# EAGLE design injector (EAGLE 6.5.0)
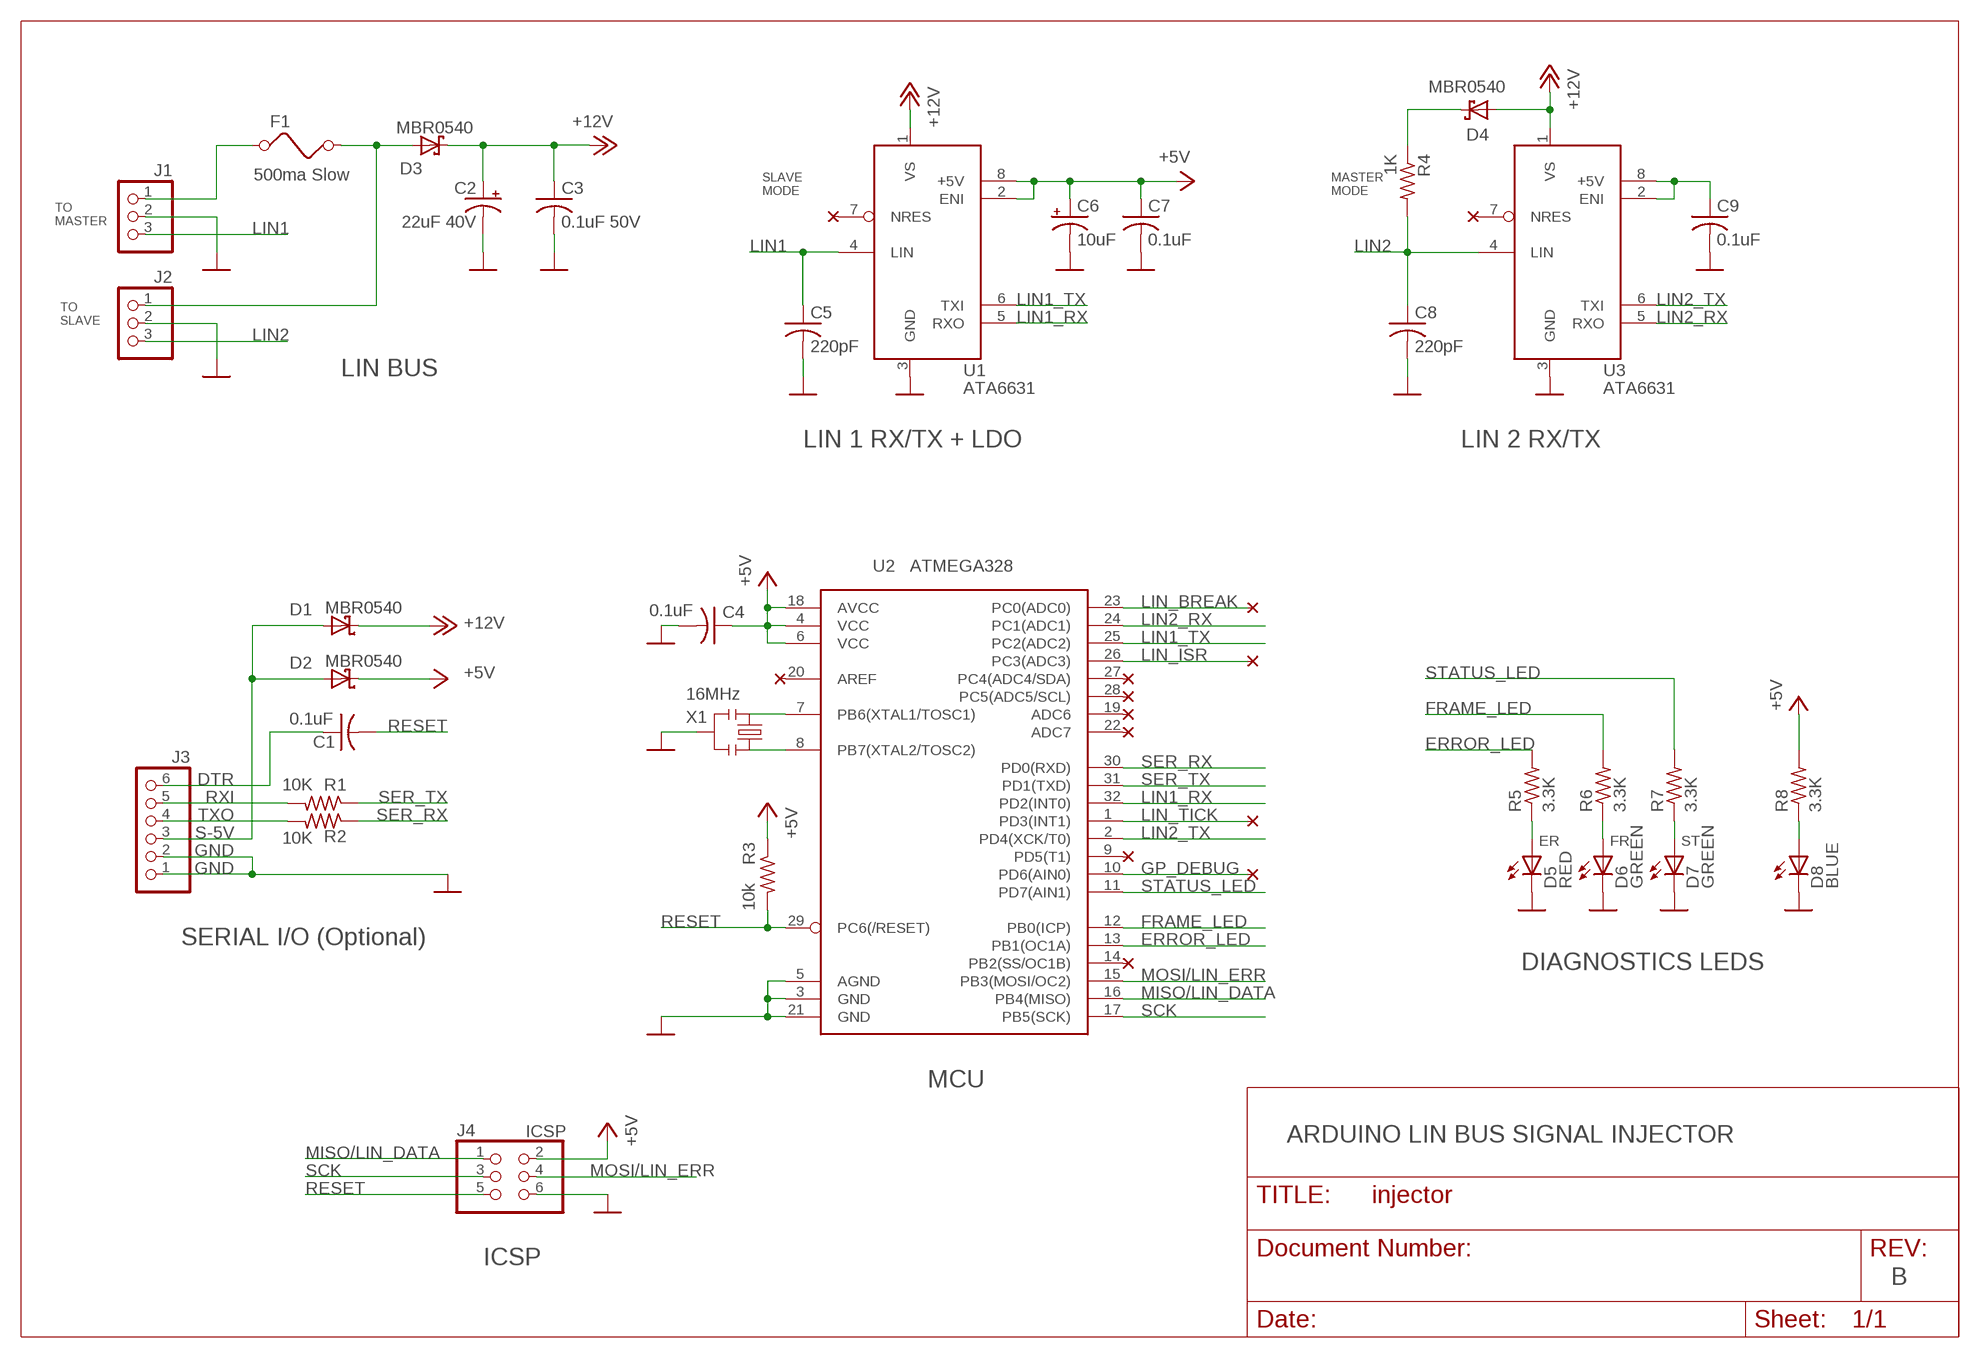
[diagram p0: schematic, sheet 1]

## Parts
C1  0.1uF  C-USC0805  [C0805]
C2  22uF 40V  CPOL-USUD-6,3X5,8  [UD-6,3X5,8_NICHICON]
C3  0.1uF 50V  C-USC0805  [C0805]
C4  0.1uF  C-USC0805  [C0805]
C5  220pF  C-USC0805  [C0805]
C6  10uF  CPOL-USA/3216-18R  [A/3216-18R]
C7  0.1uF  C-USC0805  [C0805]
C8  220pF  C-USC0805  [C0805]
C9  0.1uF  C-USC0805  [C0805]
D1  MBR0540  SMF5.0AT1  [SOD123FL]
D2  MBR0540  SMF5.0AT1  [SOD123FL]
D3  MBR0540  SMF5.0AT1  [SOD123FL]
D4  MBR0540  SMF5.0AT1  [SOD123FL]
D5  RED  LED  [1206-LED]
D6  GREEN  LED  [1206-LED]
D7  GREEN  LED  [1206-LED]
D8  BLUE  LED  [1206-LED]
F1  500ma Slow  FUSE  [1206]
J1  PINHD-1X3  [1X03]
J2  PINHD-1X3  [1X03]
J3  PINHD-1X6  [1X06]
J4  ICSP  PINHD-2X3  [2X03]
R1  10K  R-US_R0805  [R0805]
R2  10K  R-US_R0805  [R0805]
R3  10k  R-US_R0805  [R0805]
R4  1K  R-US_R0805  [R0805]
R5  3.3K  R-US_R0805  [R0805]
R6  3.3K  R-US_R0805  [R0805]
R7  3.3K  R-US_R0805  [R0805]
R8  3.3K  R-US_R0805  [R0805]
U1  ATA6631  [SO-08]
U2  ATMEGA328  [TQFP32-08]
U3  ATA6631  [SO-08]
X1  16MHz  RESONATORSMD  [RESONATOR-SMD]

## Nets
+5V: C4.1 C6.+ C7.1 D2.C J4.2 R3.1 R8.2 U1.2(ENI) U1.8(+5V) U2.4(VCC) U2.6(VCC) U2.18(AVCC)
+12V: C2.+ C3.1 D1.C D3.C D4.A U1.1(VS) U3.1(VS)
DTR: C1.1 J3.6
ERROR_LED: R5.2 U2.13(PB1(OC1A))
FRAME_LED: R6.2 U2.12(PB0(ICP))
GND: C2.- C3.2 C4.2 C5.2 C6.- C7.2 C8.2 C9.2 D5.C D6.C D7.C D8.C J1.2 J2.2 J3.1 J3.2 J4.6 U1.3(GND) U2.3(GND) U2.5(AGND) U2.21(GND) U3.3(GND) X1.2
GP_DEBUG: U2.10(PD6(AIN0))
LIN1: C5.1 J1.3 U1.4(LIN)
LIN1_RX: U1.5(RXO) U2.32(PD2(INT0))
LIN1_TX: U1.6(TXI) U2.25(PC2(ADC2))
LIN2: C8.1 J2.3 R4.2 U3.4(LIN)
LIN2_RX: U2.24(PC1(ADC1)) U3.5(RXO)
LIN2_TX: U2.2(PD4(XCK/T0)) U3.6(TXI)
LIN_BREAK: U2.23(PC0(ADC0))
LIN_ISR: U2.26(PC3(ADC3))
LIN_TICK: U2.1(PD3(INT1))
MISO/LIN_DATA: J4.1 U2.16(PB4(MISO))
MOSI/LIN_ERR: J4.4 U2.15(PB3(MOSI/OC2))
N$1: D7.A R7.1
N$2: D8.A R8.1
N$3: D6.A R6.1
N$4: D5.A R5.1
N$6: D3.A F1.2 J2.1
N$9: D4.C R4.1
RESET: C1.2 J4.5 R3.2 U2.29(PC6(/RESET))
RXI: J3.5 R1.2
S-5V: D1.A D2.A J3.3
SCK: J4.3 U2.17(PB5(SCK))
SECONDARY_5V: C9.1 U3.2(ENI) U3.8(+5V)
SER_RX: R2.1 U2.30(PD0(RXD))
SER_TX: R1.1 U2.31(PD1(TXD))
STATUS_LED: R7.2 U2.11(PD7(AIN1))
TXO: J3.4 R2.2
VBAT: F1.1 J1.1
XTAL1: U2.7(PB6(XTAL1/TOSC1)) X1.3
XTAL2: U2.8(PB7(XTAL2/TOSC2)) X1.1
Unconnected: U1.7(NRES) U2.9(PD5(T1)) U2.14(PB2(SS/OC1B)) U2.19(ADC6) U2.20(AREF) U2.22(ADC7) U2.27(PC4(ADC4/SDA)) U2.28(PC5(ADC5/SCL)) U3.7(NRES)

## Notes on the sheet
- SLAVE
  MODE
- MASTER
  MODE
- TO
  MASTER
- TO
  SLAVE
- LIN BUS
- LIN 1 RX/TX + LDO | LIN 2 RX/TX
- ER | FR | ST
- SERIAL I/O (Optional)
- DIAGNOSTICS LEDS
- MCU
- ARDUINO LIN BUS SIGNAL INJECTOR
- ICSP
- B

## Library data of the parts
C1 C3-C5 C7-C9 = injector:C-US
C2 C6 = injector:CPOL-US
D1-D4 = injector:SMF5.0AT1
D5-D8 = injector:LED
F1 = injector:FUSE
J1 J2 = injector:PINHD-1X3
J3 = injector:PINHD-1X6
J4 = injector:PINHD-2X3
R1-R8 = injector:R-US_
U1 U3 = injector:ATA6631
U2 = injector:ATMEGA328
X1 = injector:RESONATOR

## Net classes
1 vcc: width 0.254 mm

## Board
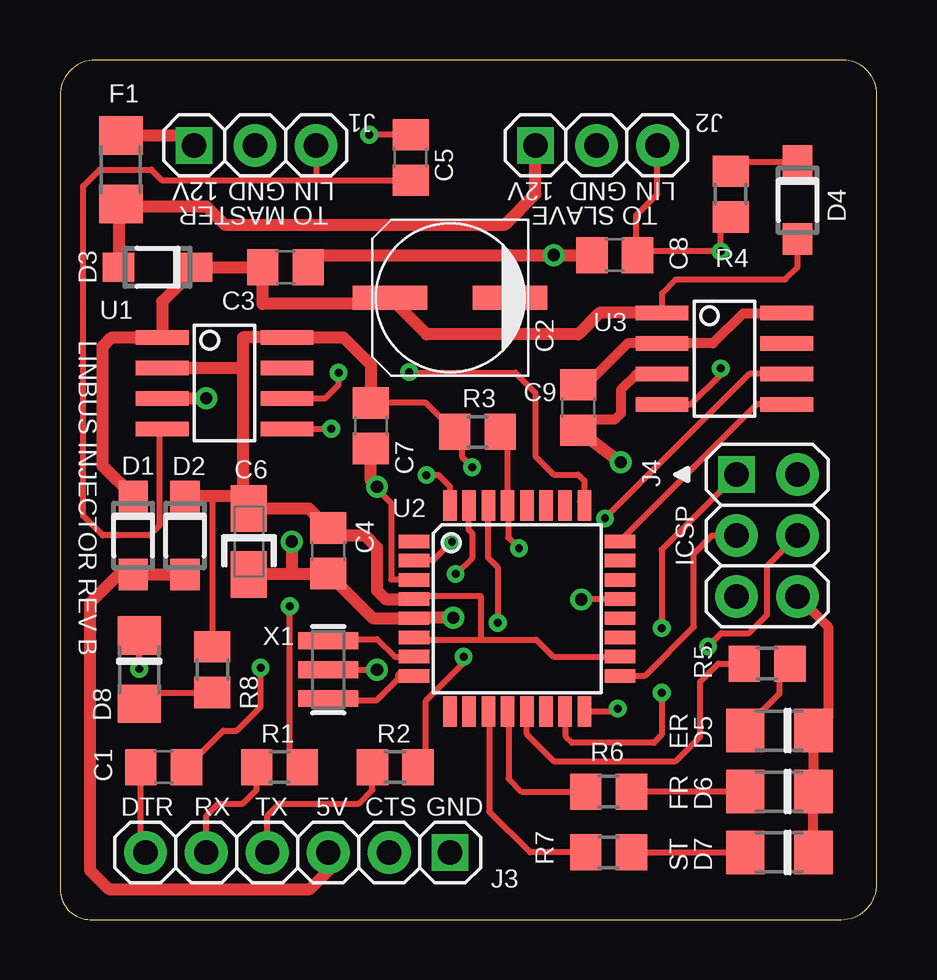
[diagram p1: board, top side]
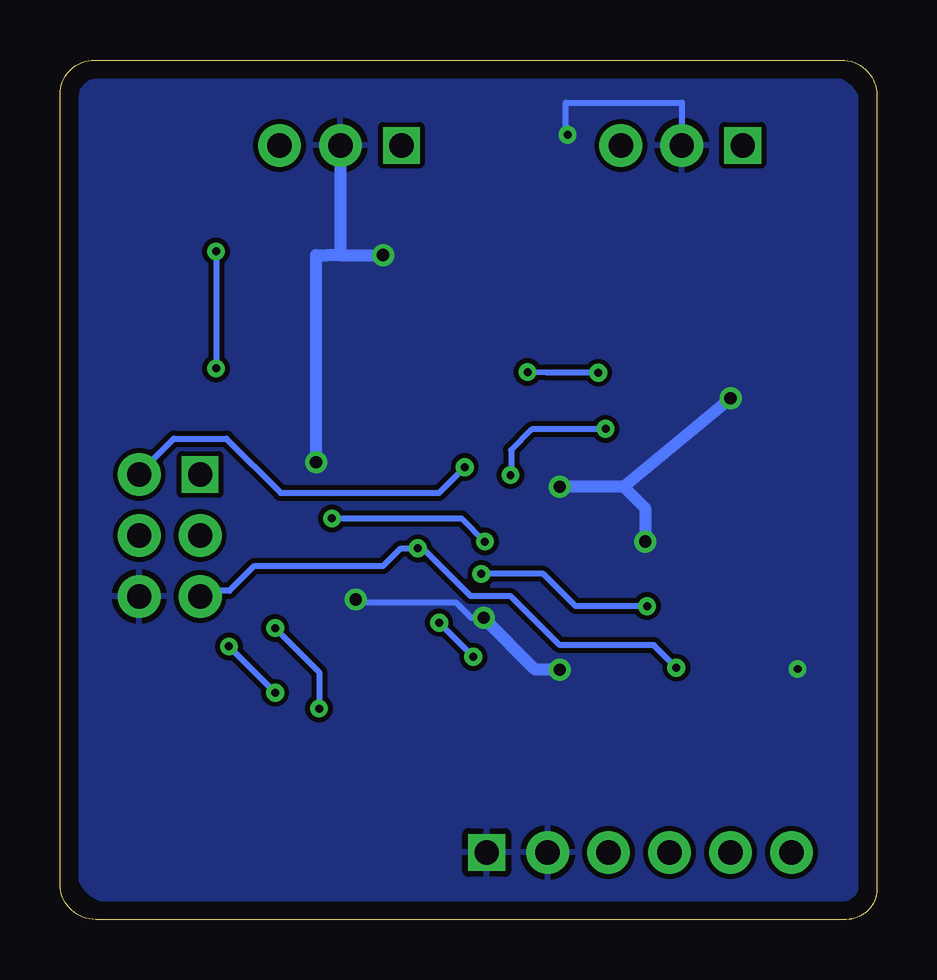
[diagram p2: board, bottom side, seen from below]

Size 34.04 x 35.81 mm. Coordinates in mm from the lower left corner, seen from the top.
Outline: 0,34.33 0,1.27 arc90 1.27,0 32.55,0 arc90 34.04,1.48 34.04,34.38 arc90 32.6,35.81 1.48,35.81 arc90 0,34.33
Copper layers (1*16): Top 0.035mm / dielectric 1.5mm / Bottom 0.035mm
Design rules "default *": minimum track width 10mil, minimum drill 13mil, track to track 8mil, track to pad 8mil, pad to pad 8mil, via to via 8mil, smd to smd 0mil, copper to edge 30mil, drill to drill 8mil, minimum pad ring 10mil, minimum via ring 8mil, stop-mask expansion 4mil, vias tented up to drill 20mil, thermal gap 10mil
tRestrict: area 29.2,24.4 to 31.2,24.9; area 29.2,23.1 to 31.2,23.6; area 29.2,21.8 to 31.2,22.4; area 24.1,21.8 to 26.2,22.4; area 24.1,23.1 to 26.2,23.6; area 24.1,24.4 to 26.2,24.9; area 3.3,23.4 to 5.3,23.9; area 3.3,22.1 to 5.3,22.6; area 3.3,20.8 to 5.3,21.3; area 8.4,20.8 to 10.4,21.3; area 8.4,22.1 to 10.4,22.6; area 8.4,23.4 to 10.4,23.9

### Footprints (pad centres in the part's own frame; a part is rotated, then mirrored left to right if it is on the bottom)
C0805 = smd 1.3 x 1.5: 1 -0.95,0; 2 0.95,0
UD-6,3X5,8_NICHICON = smd 3.1 x 1: + 2.5,0; - -2.5,0
A/3216-18R = smd 1.95 x 1.5: + 1.375,0; - -1.375,0
SOD123FL = smd 1.31 x 1.22: A 1.625,0; C -1.625,0
1206-LED = smd 1.6 x 1.803: A -1.422,0; C 1.422,0
1206 = smd 1.6 x 1.803: 1 -1.422,0; 2 1.422,0
1X03 = drill 1.016 square: 1 -2.54,0 | drill 1.016 pad 1.778: 2 0,0; 3 2.54,0
1X06 = drill 1.016 square: 1 6.35,0 | drill 1.016 pad 1.778: 2 3.81,0; 3 1.27,0; 4 -1.27,0; 5 -3.81,0; 6 -6.35,0
2X03 = drill 1.016 square: 1 -2.54,-1.27 | drill 1.016 pad 1.778: 2 -2.54,1.27; 3 0,-1.27; 4 0,1.27; 5 2.54,-1.27; 6 2.54,1.27
R0805 = smd 1.3 x 1.5: 1 -0.95,0; 2 0.95,0
SO-08 = smd 0.6 x 2.2: 1 -1.905,-2.6; 2 -0.635,-2.6; 3 0.635,-2.6; 4 1.905,-2.6; 5 1.905,2.6; 6 0.635,2.6; 7 -0.635,2.6; 8 -1.905,2.6
TQFP32-08 = smd 1.27 x 0.559: 1 -4.293,2.8; 2 -4.293,2; 3 -4.293,1.2; 4 -4.293,0.4; 5 -4.293,-0.4; 6 -4.293,-1.2; 7 -4.293,-2; 8 -4.293,-2.8; 17 4.293,-2.8; 18 4.293,-2; 19 4.293,-1.2; 20 4.293,-0.4; 21 4.293,0.4; 22 4.293,1.2; 23 4.293,2; 24 4.293,2.8 | smd 0.559 x 1.27: 9 -2.8,-4.293; 10 -2,-4.293; 11 -1.2,-4.293; 12 -0.4,-4.293; 13 0.4,-4.293; 14 1.2,-4.293; 15 2,-4.293; 16 2.8,-4.293; 25 2.8,4.293; 26 2,4.293; 27 1.2,4.293; 28 0.4,4.293; 29 -0.4,4.293; 30 -1.2,4.293; 31 -2,4.293; 32 -2.8,4.293
RESONATOR-SMD = smd 0.7 x 2.5: 1 -1.2,0; 2 0,0; 3 1.2,0

### Placement (x,y rotation side)
C1  4.32,6.35 0 top
C2  16.26,25.91 180 top
C3  9.4,27.18 0 top
C4  11.18,15.37 270 top
C5  14.61,31.75 90 top
C6  7.87,15.75 90 top
C7  12.95,20.57 270 top
C8  23.11,27.69 180 top
C9  21.59,21.34 270 top
D1  3.05,16 270 top
D2  5.21,16 270 top
D3  4.06,27.18 180 top
D4  30.73,29.97 270 top
D5  29.97,7.87 0 top
D6  29.97,5.33 0 top
D7  29.97,2.79 0 top
D8  3.3,10.41 90 top
F1  2.54,31.24 270 top
J1  8.13,32.26 0 top
J2  22.35,32.26 0 top
J3  9.91,2.79 0 top
J4  29.46,16 270 top
R1  9.14,6.35 180 top
R2  13.97,6.35 180 top
R3  17.4,20.32 0 top
R4  27.94,30.23 270 top
R5  29.46,10.67 180 top
R6  22.86,5.33 180 top
R7  22.86,2.79 180 top
R8  6.35,10.41 90 top
U1  6.86,22.35 270 top
U2  19.05,12.95 0 top
U3  27.69,23.37 270 top
X1  11.18,10.41 90 top

### Tracks (layer width: path | path; a pad name or v marks a point on that pad's centre or on a via)
+5V  (via drill 0.33)
  Top 0.254: U2.4 14.78,13.49 17.53,13.49 17.53,11.66 | 7.37,17.63 C6.+ 7.39,17.63 7.62,17.63 | R3.1 15.24,21.52 C7.1 | U2.6 14.85,11.66 17.53,11.66 | 17.53,11.66 19.84,11.66 20.54,10.95 U2.18 | 6.35,17.63 R8.2 | 16.54,20.24 R3.1 | v17.17,18.85 16.76,19.25 16.76,20.07 16.51,20.32 R3.1
  Top 0.508: C7.1 12.95,23.11 11.81,24.26 U1.8 7.62,24.26 7.62,22.99 | C6.+ 10.37,17.12 C4.1 11.49,16 12.7,16 13.21,15.49 13.21,13.72 13.57,13.35 U2.4 | 7.37,17.63 6.35,17.63 D2.C | 7.62,22.99 7.62,17.63 7.62,17.53 | U1.2 7.62,22.99
  Bottom 0.254: J4.2 30.73,18.59 29.29,20.04 27.1,20.04 24.84,17.78 18.24,17.78 v17.17,18.85
+12V
  Top 0.254: D4.A 30.73,27.18 30.23,26.67 25.65,26.67 25.09,26.1 U3.1 | 8.45,25.72 8.43,25.7 8.43,25.65
  Top 0.508: 8.43,25.65 13.5,25.65 C2.+ 15.28,24.38 21.59,24.38 22.48,25.27 U3.1 | 8.45,25.72 C3.1 D3.C 4.26,25.75 U1.1 2.16,24.26 1.78,23.88 1.78,18.9 D1.C
DTR
  Top 0.254: J3.6 3.37,2.98 C1.1
ERROR_LED
  Top 0.254: U2.13 19.45,7.73 20.57,6.6 25.65,6.6 26.67,7.62 26.67,9.91 27.43,10.67 R5.2
  Top 0.508: U2.13 19.43,8.64
FRAME_LED
  Top 0.254: U2.12 18.69,8.62 18.69,5.87 19.23,5.33 R6.2
GND  (via drill 0.33, 0.51)
  Top 0.254: X1.2 v13.21,10.41 | 14.78,12.57 U2.5 | U2.21 21.74,13.35 v21.72,13.34 | C5.2 v12.89,32.7 | U2.3 14.76,14.17 13.79,14.17 13.79,17.35 13.34,17.8 v13.21,18.03 | v3.3,10.44 D8.C | 32,8.46 31.62,8.46 D5.C
  Top 0.406: D7.C D6.C 31.39,7.77 | J4.6 32,12.19 32,8.46 32,8.38 | U3.3 25.06,22.71 24,22.71 23.37,22.07 23.37,21.08 23.11,20.83 22.1,20.83 21.66,20.39 C9.2
  Top 0.508: 18.76,27.69 C2.- | C6.- 7.92,14.42 9.65,14.42 | 9.65,14.42 C4.2 13.04,12.55 U2.5 | v16.38,12.57 14.78,12.57 | C9.2 v23.37,19.05 | 31.39,7.77 D5.C | U1.3 v6.1,21.72 | v13.21,18.03 12.95,18.29 C7.2 | C3.2 10.86,27.69 18.76,27.69 | v9.65,15.75 9.65,14.42 | 18.76,27.69 v20.57,27.69 C8.2
  Bottom 0.254: v16.38,12.57 16.89,12.57 17.53,13.21 21.59,13.21 v21.72,13.34 | v12.89,32.7 12.95,32.7 12.95,34.04 8.13,34.04 J1.2
  Bottom 0.508: v13.21,10.41 14.22,10.41 v16.38,12.57 | v23.37,19.05 23.37,27.69 22.86,27.69 22.35,27.69 | v6.1,21.72 10.54,18.03 | 10.54,18.03 v13.21,18.03 | 10.54,18.03 9.65,17.14 v9.65,15.75 | 22.35,27.69 v20.57,27.69 | J2.2 22.35,27.69
  pour Bottom: 33.27,2.2 33.27,33.97 arc90 32.2,35.05 2.03,35.05 arc90 0.76,33.78 0.76,1.68 arc90 1.68,0.76 31.84,0.76 arc90
LIN1
  Top 0.254: 10.67,30.81 C5.1 | 4.24,20.45 U1.4 4.26,20.34 4.14,20.22 4.14,16.41 3.73,16 1.78,16 0.96,16.82 0.96,30.56 1.65,31.24 3.81,31.24 4.24,30.81 10.41,30.81 10.67,30.81 | J1.3 10.67,30.81
LIN1_RX  (via drill 0.33)
  Top 0.254: U1.5 v11.3,20.45 | U2.32 16.26,18.03 15.77,18.52 v15.27,18.52
  Bottom 0.254: v11.3,20.45 11.33,20.42 14.38,20.42 15.24,19.56 15.24,18.54 v15.27,18.52
LIN1_TX  (via drill 0.33)
  Top 0.254: 21.67,17.42 U2.25 21.84,18.29 21.59,18.54 20.57,18.54 19.81,19.3 19.81,21.95 18.97,22.78 14.58,22.78 v14.55,22.81 | U1.6 11.05,21.72 11.61,22.28 v11.61,22.78
  Bottom 0.254: v14.55,22.81 13.77,22.78 v11.61,22.78
LIN2  (via drill 0.33)
  Top 0.254: 27.94,29.26 R4.2 27.53,28.87 v27.53,27.84 24.22,27.84 C8.1 24,27.79 24,29.34 24.89,30.23 J2.3 | U3.4 26.29,21.46 27.53,22.71 v27.53,22.96
  Bottom 0.254: v27.53,27.84 v27.53,22.96
LIN2_RX
  Top 0.254: U3.5 29.03,21.46 23.34,15.77 U2.24
LIN2_TX  (via drill 0.33)
  Top 0.254: v16.33,15.75 15.54,14.96 14.76,14.96 U2.2 | v22.71,16.71 28.73,22.73 U3.6
  Bottom 0.254: v16.33,15.75 17.3,16.71 v22.71,16.71
MISO/LIN_DATA  (via drill 0.33)
  Top 0.254: J4.1 25.07,15.42 v25.07,12.14 | 21.87,8.66 U2.16 23.11,8.66 v23.24,8.79
  Bottom 0.254: v25.07,12.14 23.24,10.31 v23.24,8.79
MOSI/LIN_ERR  (via drill 0.33)
  Top 0.254: v25.07,9.45 25.07,7.7 24.74,7.37 21.34,7.37 21.08,7.62 21.08,8.63 U2.15 | J4.4 29.46,14.73 29.46,12.7 28.7,11.94 27.56,11.94 v27,11.38
  Bottom 0.254: v27,11.38 v25.07,9.45
N$1
  Top 0.254: 24.06,2.79 D7.A
  Top 0.508: R7.1 24.06,2.79
N$2
  Top 0.254: D8.A 3.3,9.45 R8.1
N$3
  Top 0.254: D6.A R6.1
N$4
  Top 0.254: R5.1 29.97,10.23 29.97,9.4 28.7,8.13 D5.A
N$6
  Top 0.508: D3.A 2.44,29.72 F1.2 2.64,29.72 6.1,29.72 6.86,28.96 18.54,28.96 19.81,30.23 J2.1
N$9
  Top 0.254: R4.1 27.94,31.57 30.73,31.57 D4.C
RESET  (via drill 0.33)
  Top 0.254: R3.2 18.65,20.32 U2.29 18.59,17.14 18.67,17.07 18.67,15.93 v19.13,15.47 | C1.2 5.28,6.35 6.81,7.87 7.37,7.87 8.36,8.87 v8.36,10.49
  Bottom 0.254: J4.5 27.96,13.69 26.98,13.69 25.93,14.73 20.57,14.73 19.84,15.47 v19.13,15.47 18.92,15.47 16.94,13.49 15.27,13.49 13.21,11.43 9.3,11.43 v8.36,10.49
RXI
  Top 0.254: J3.5 6.1,4.32 6.6,4.83 7.62,4.83 8.19,5.4 R1.2
S-5V
  Top 0.508: D2.A D1.A 2.44,14.38 1.27,13.21 1.27,2.03 2.03,1.27 10.41,1.27 11.18,2.03 J3.3
SCK
  Top 0.254: U2.17 24.38,10.16 26.42,12.19 26.42,15.24 27.18,16 J4.3
SECONDARY_5V
  Top 0.406: U3.8 30.26,25.25 28.45,25.25 27.2,24 U3.2 23.65,24 21.93,22.29 C9.1
SER_RX  (via drill 0.33)
  Top 0.254: U2.30 17.83,17.22 17.83,15.09 18.24,14.68 v18.24,12.37 | R2.1 14.94,6.35 15.24,6.66 15.24,9.12 16.82,10.69 v16.82,10.95
  Bottom 0.254: v16.82,10.95 v18.24,12.37
SER_TX  (via drill 0.33)
  Top 0.254: v9.58,13.06 9.58,6.86 R1.1 | U2.31 17.02,17.22 17.02,16.26 17.17,16.1 17.17,15.06 16.51,14.4 v16.48,14.4
  Bottom 0.254: v9.58,13.06 12.55,13.06 13.89,14.4 v16.48,14.4
STATUS_LED
  Top 0.254: U2.11 17.88,8.63 17.88,4.5 19.58,2.79 R7.2
TXO
  Top 0.254: J3.4 8.64,4.32 9.14,4.83 12.45,4.83 13.02,5.4 R2.2
  Top 0.508: 13.02,6.16 R2.2
VBAT
  Top 0.508: J1.1 5.18,32.66 F1.1
XTAL1
  Top 0.254: 11.25,11.68 13.21,11.68 13.94,10.95 U2.7
  Top 0.508: X1.3 11.25,11.68
XTAL2
  Top 0.254: 11.25,9.14 13.21,9.14 14.22,10.15
  Top 0.508: X1.1 11.25,9.14 | 14.22,10.15 U2.8

### Text on the board
tPlace: 12V | 12V | GND | LIN | 12V | GND | LIN | TO MASTER | TO SLAVE | LINBUS INJECTOR REV B | ICSP | ER | FR | DTR | RX | TX | 5V | CTS | GND | ST
bStop: TO MASTER | TO SLAVE | LINBUS INJECTOR - REV B